# EAGLE design ps2-1351 (EAGLE 4.11)
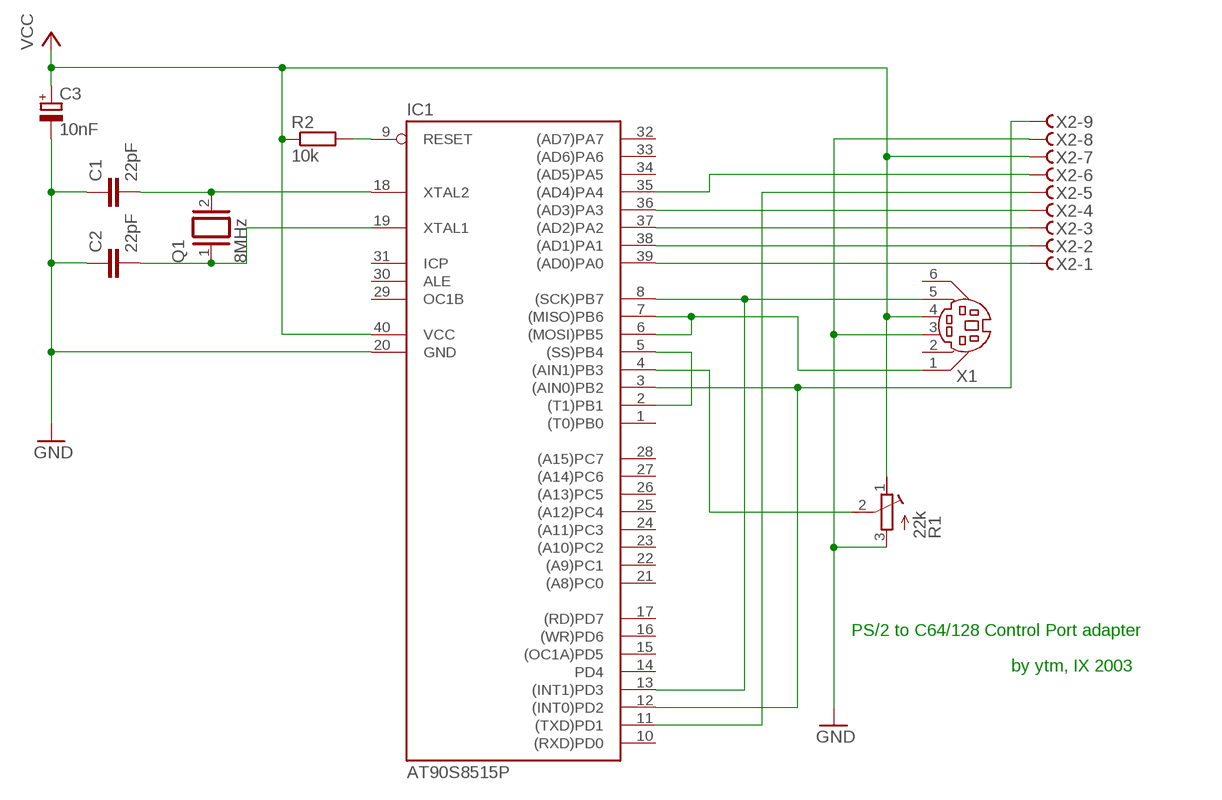
[diagram p0: schematic, sheet 1]

## Parts
C1  22pF  C2.5/2  [C2.5-2]
C2  22pF  C2.5/2  [C2.5-2]
C3  10nF  CPOL-EUE2,5-6E  [E2,5-6E]
IC1  AT90S8515P  [DIL40]
Q1  8MHz  XTAL  [Q]
R1  22k  R-TRIMM43P  [RTRIM43P]
R2  10k  R-EU_0204/2V  [0204V]
X1  MDIN06K  [MDIN06K]
X2  F09HS  [F09H]

## Nets
GND: C1.1 C2.1 C3.- IC1.20(GND) R1.3(E) X1.3 X2.8
N$1: IC1.9(RESET) R2.2
N$2: C1.2 IC1.18(XTAL2) Q1.2
N$3: C2.2 IC1.19(XTAL1) Q1.1
N$4: IC1.35((AD4)PA4) X2.6
N$5: IC1.8((SCK)PB7) IC1.13((INT1)PD3) X1.5
N$7: IC1.6((MOSI)PB5) IC1.7((MISO)PB6) X1.1
N$8: IC1.2((T1)PB1) IC1.5((SS)PB4)
N$9: IC1.39((AD0)PA0) X2.1
N$10: IC1.38((AD1)PA1) X2.2
N$11: IC1.37((AD2)PA2) X2.3
N$12: IC1.36((AD3)PA3) X2.4
N$13: IC1.11((TXD)PD1) X2.5
N$14: IC1.3((AIN0)PB2) IC1.12((INT0)PD2) X2.9
N$15: IC1.4((AIN1)PB3) R1.2(S)
VCC: C3.+ IC1.40(VCC) R1.1(A) R2.1 X1.4 X2.7
Unconnected: IC1.1((T0)PB0) IC1.10((RXD)PD0) IC1.14(PD4) IC1.15((OC1A)PD5) IC1.16((WR)PD6) IC1.17((RD)PD7) IC1.21((A8)PC0) IC1.22((A9)PC1) IC1.23((A10)PC2) IC1.24((A11)PC3) IC1.25((A12)PC4) IC1.26((A13)PC5) IC1.27((A14)PC6) IC1.28((A15)PC7) IC1.29(OC1B) IC1.30(ALE) IC1.31(ICP) IC1.32((AD7)PA7) IC1.33((AD6)PA6) IC1.34((AD5)PA5) X1.2 X1.6

## Notes on the sheet
- PS/2 to C64/128 Control Port adapter
- by ytm, IX 2003

## Library data of the parts
C1 C2 = capacitor-wima:C: CAPACITOR naming: grid - package width
C3 = rcl:CPOL-EU: POLARIZED CAPACITOR, European symbol
IC1 = atmel:AT90S8515P: MICROCONTROLLER 8 Kbytes FLASH 512 bytes SRAM 512 bytes EEPROM UART
Q1 = special:XTAL: CRYSTAL
R1 = rcl:R-TRIMM: Trimm resistor
R2 = rcl:R-EU_: RESISTOR, European symbol
X1 = con-yamaichi:MDIN06K: YAMAICHI CONNECTOR
X2 = con-subd:F09?S: SUB-D

## Board
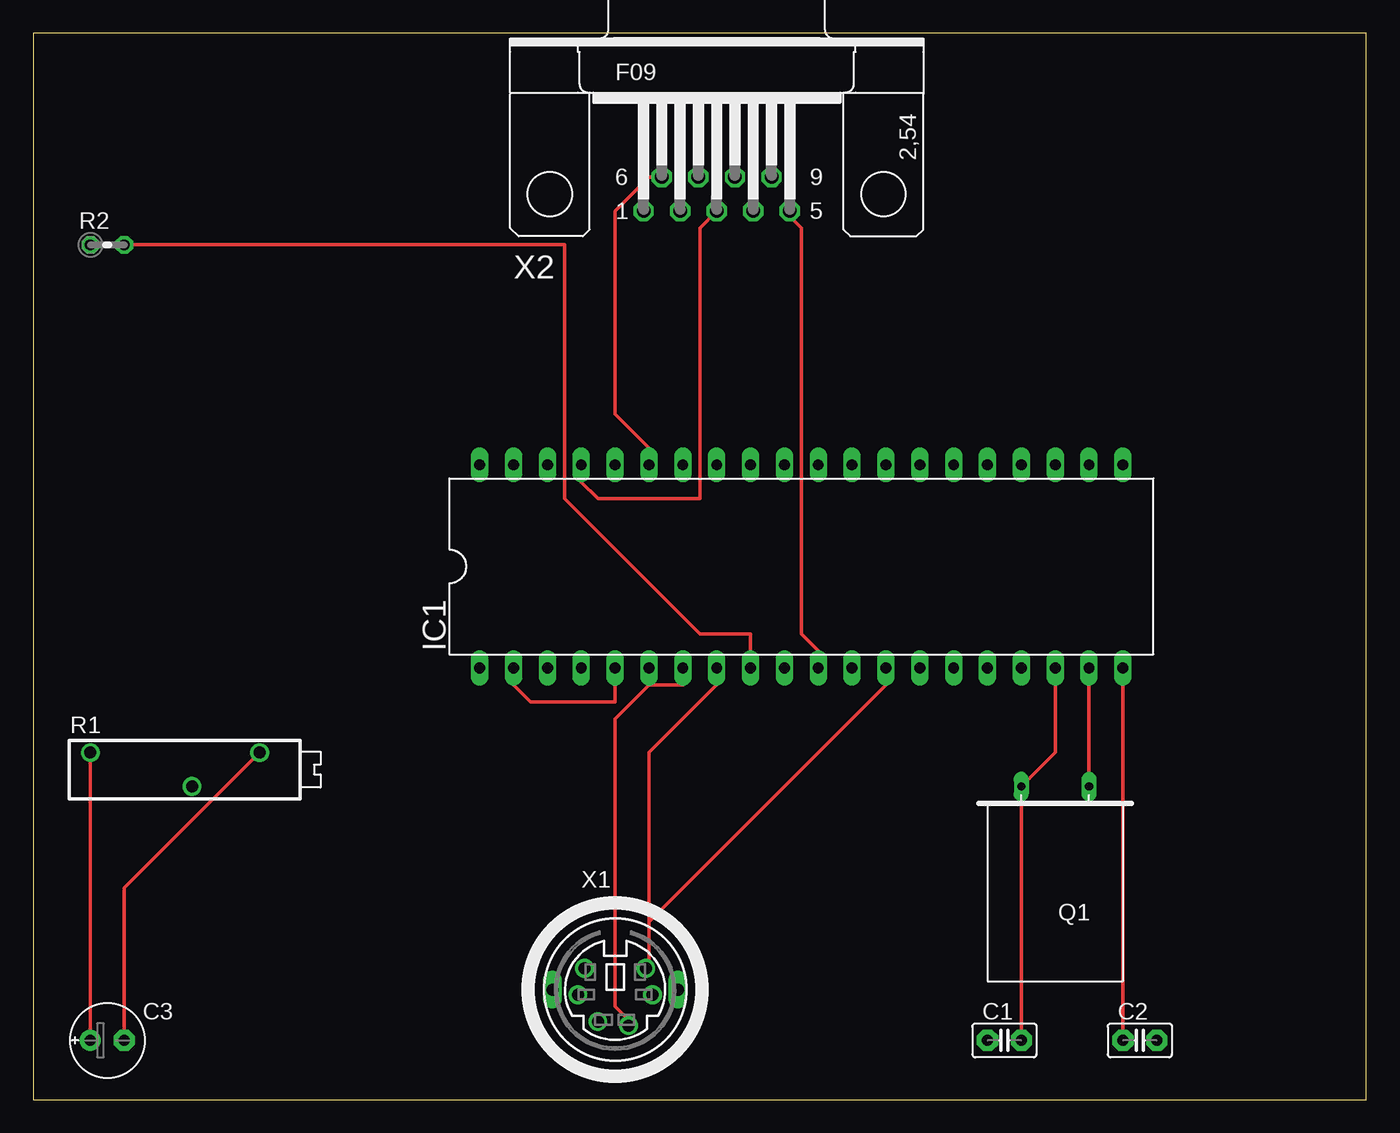
[diagram p1: board, top side]
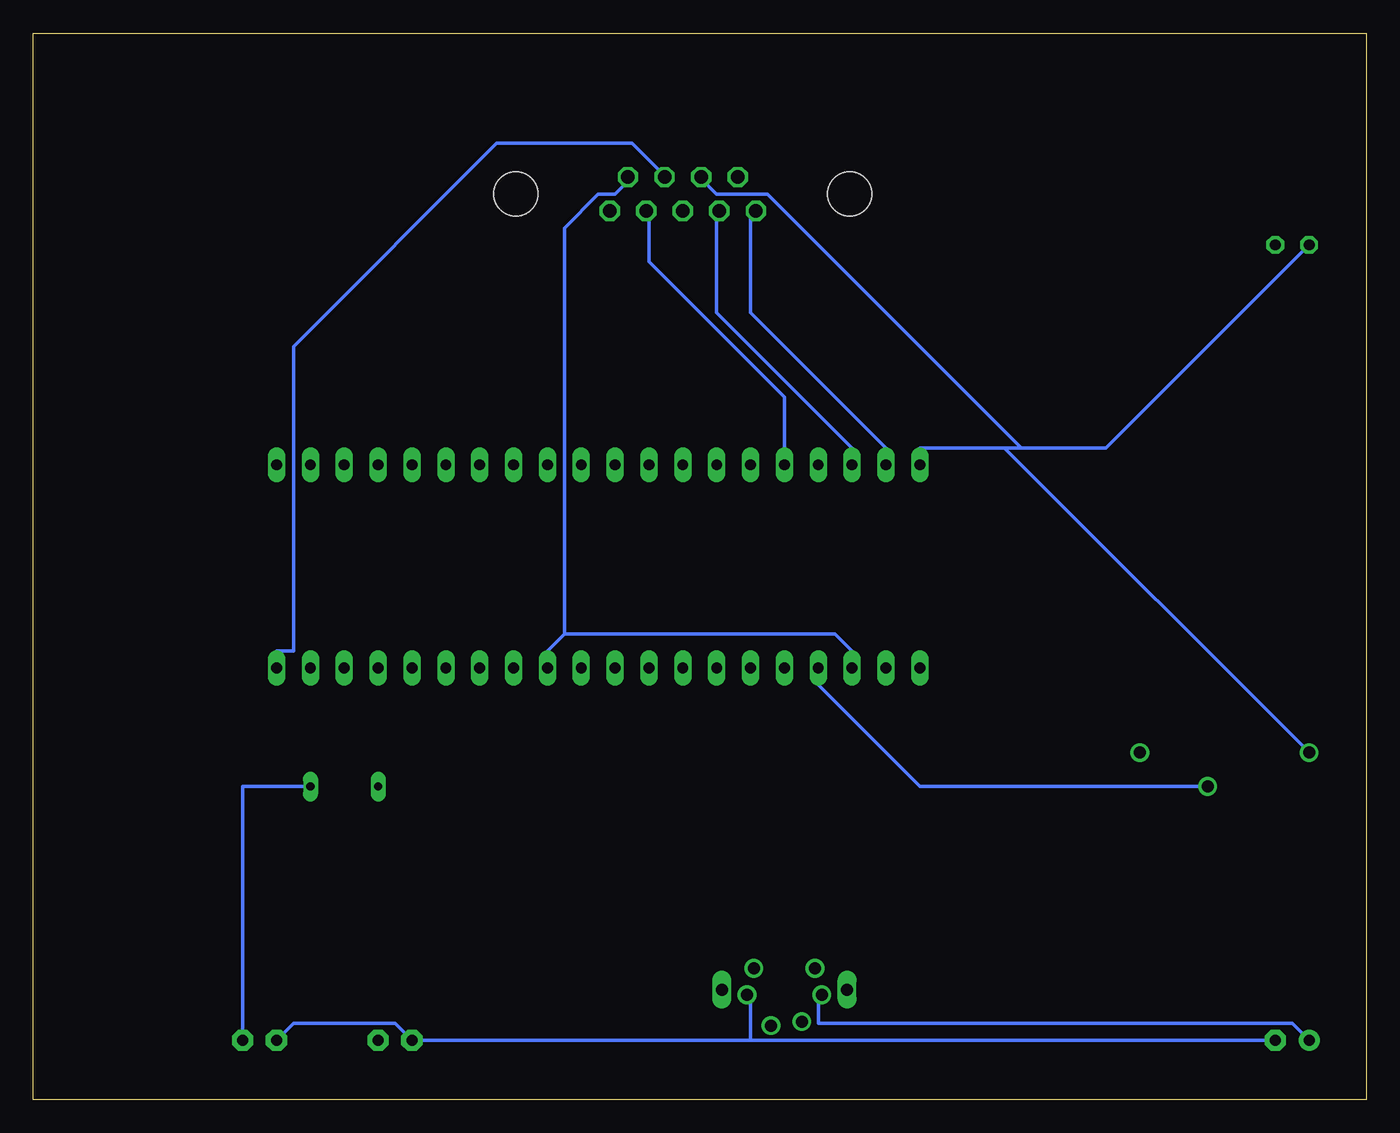
[diagram p2: board, bottom side, seen from below]

Size 100 x 80 mm. Coordinates in mm from the lower left corner, seen from the top.
Outline: 0,0 100,0 100,80 0,80 0,0
Copper layers (1*16): Top 0.035mm / dielectric 1.5mm / Bottom 0.035mm
Design rules "default": minimum track width 10mil, minimum drill 24mil, track to track 8mil, track to pad 8mil, pad to pad 8mil, via to via 8mil, smd to smd 8mil, copper to edge 40mil, drill to drill 8mil, minimum pad ring 10mil, minimum via ring 8mil, stop-mask expansion 4mil, vias tented up to drill 0mil, thermal gap 10mil

### Footprints (pad centres in the part's own frame; a part is rotated, then mirrored left to right if it is on the bottom)
C2.5-2 = drill 0.813 pad 1.6 octagon: 1 -1.27,0; 2 1.27,0
E2,5-6E = drill 0.813 pad 1.575 round: + -1.27,0 | drill 0.813 pad 1.575 octagon: - 1.27,0
DIL40 = drill 0.813 long: 1 -24.13,-7.62; 2 -21.59,-7.62; 3 -19.05,-7.62; 4 -16.51,-7.62; 5 -13.97,-7.62; 6 -11.43,-7.62; 7 -8.89,-7.62; 8 -6.35,-7.62; 9 -3.81,-7.62; 10 -1.27,-7.62; 11 1.27,-7.62; 12 3.81,-7.62; 13 6.35,-7.62; 14 8.89,-7.62; 15 11.43,-7.62; 16 13.97,-7.62; 17 16.51,-7.62; 18 19.05,-7.62; 19 21.59,-7.62; 20 24.13,-7.62; 21 24.13,7.62; 22 21.59,7.62; 23 19.05,7.62; 24 16.51,7.62; 25 13.97,7.62; 26 11.43,7.62; 27 8.89,7.62; 28 6.35,7.62; 29 3.81,7.62; 30 1.27,7.62; 31 -1.27,7.62; 32 -3.81,7.62; 33 -6.35,7.62; 34 -8.89,7.62; 35 -11.43,7.62; 36 -13.97,7.62; 37 -16.51,7.62; 38 -19.05,7.62; 39 -21.59,7.62; 40 -24.13,7.62
Q = drill 0.61 long: 1 -2.54,-7.62; 2 2.54,-7.62
RTRIM43P = drill 0.9 round: 1 -7.62,1.27; 2 0,-1.27; 3 5.08,1.27
0204V = drill 0.813 octagon: 1 -1.27,0; 2 1.27,0
MDIN06K = drill 0.9 round: 1 1,-2.7; 2 -1.3,-2.4; 3 2.8,-0.4; 4 -2.8,-0.4; 5 2.3,1.6; 6 -2.3,1.6 | drill 0.9 long: M1 -4.7,0; M2 4.7,0
F09H = drill 1.016 octagon: 1 -5.486,-1.27; 2 -2.743,-1.27; 3 0,-1.27; 4 2.743,-1.27; 5 5.486,-1.27; 6 -4.115,1.27; 7 -1.372,1.27; 8 1.372,1.27; 9 4.115,1.27 | hole 3.302: -12.522,0; 12.522,0

### Placement (x,y rotation side)
C1  72.86,4.44 0 top
C2  83.02,4.44 0 top
C3  5.55,4.44 0 top
IC1  57.62,40 0 top
Q1  76.67,15.87 180 top
R1  11.9,24.76 0 top
R2  5.55,64.13 0 top
X1  43.65,8.25 0 top
X2  51.27,67.94 0 top

### Tracks (layer width: path | path; a pad name or v marks a point on that pad's centre or on a via)
GND
  Top 0.254: R1.3 6.82,15.87 C3.- | C2.1 IC1.20
  Bottom 0.254: 46.19,4.44 46.19,8.25 X1.3 | 46.19,4.44 C1.1 72.86,5.71 80.48,5.71 C2.1 | X2.8 52.54,69.21 55.08,71.75 65.24,71.75 80.48,56.51 80.48,33.65 81.75,33.65 IC1.20 | C3.- 46.19,4.44
N$1
  Top 0.254: R2.2 39.84,64.13 39.84,45.08 50,34.92 53.81,34.92 IC1.9
N$2
  Top 0.254: IC1.18 76.67,26.03 Q1.2 C1.2
N$3
  Top 0.254: Q1.1 IC1.19
  Bottom 0.254: C2.2 84.29,23.49 Q1.1
N$4
  Top 0.254: IC1.35 46.19,48.89 43.65,51.43 43.65,66.67 46.19,69.21 X2.6 47.46,69.21
N$5
  Top 0.254: 46.19,13.33 46.19,9.52 X1.5 | 46.19,13.33 46.19,26.03 51.27,31.11 IC1.8 | 46.19,13.33 63.97,31.11 IC1.13
N$7
  Top 0.254: 46.19,31.11 48.73,31.11 IC1.7 | 46.19,31.11 43.65,28.57 43.65,6.98 44.92,5.71 X1.1 | 46.19,31.11 IC1.6
N$8
  Top 0.254: IC1.2 36.03,31.11 37.3,29.84 43.65,29.84 IC1.5
N$9
  Bottom 0.254: IC1.39 36.03,48.89 46.19,59.05 46.19,66.67 X2.1
N$10
  Bottom 0.254: IC1.38 38.57,48.89 48.73,59.05 48.73,66.67 X2.2
N$11
  Top 0.254: X2.3 50,65.4 50,45.08 42.38,45.08 41.11,46.35 IC1.37
N$12
  Bottom 0.254: IC1.36 43.65,52.7 53.81,62.86 53.81,66.67 X2.4
N$13
  Top 0.254: IC1.11 58.89,33.65 57.62,34.92 57.62,65.4 56.35,66.67 X2.5
N$14
  Bottom 0.254: 60.16,34.92 39.84,34.92 38.57,33.65 IC1.3 | 60.16,34.92 61.43,33.65 IC1.12 | 60.16,34.92 60.16,65.4 57.62,67.94 56.35,67.94 55.08,69.21 X2.9
N$15
  Bottom 0.254: R1.2 33.49,23.49 41.11,31.11 IC1.4
VCC
  Top 0.254: C3.+ R1.1
  Bottom 0.254: C3.+ 5.55,5.71 41.11,5.71 41.11,8.25 X1.4 | R2.1 19.52,48.89 25.87,48.89 | 27.14,48.89 33.49,48.89 IC1.40 | 27.14,48.89 25.87,48.89 | 25.87,48.89 44.92,67.94 48.73,67.94 50,69.21 X2.7 | R1.1 27.14,48.89